# EAGLE design edges_expander_v01 (EAGLE 5.09)
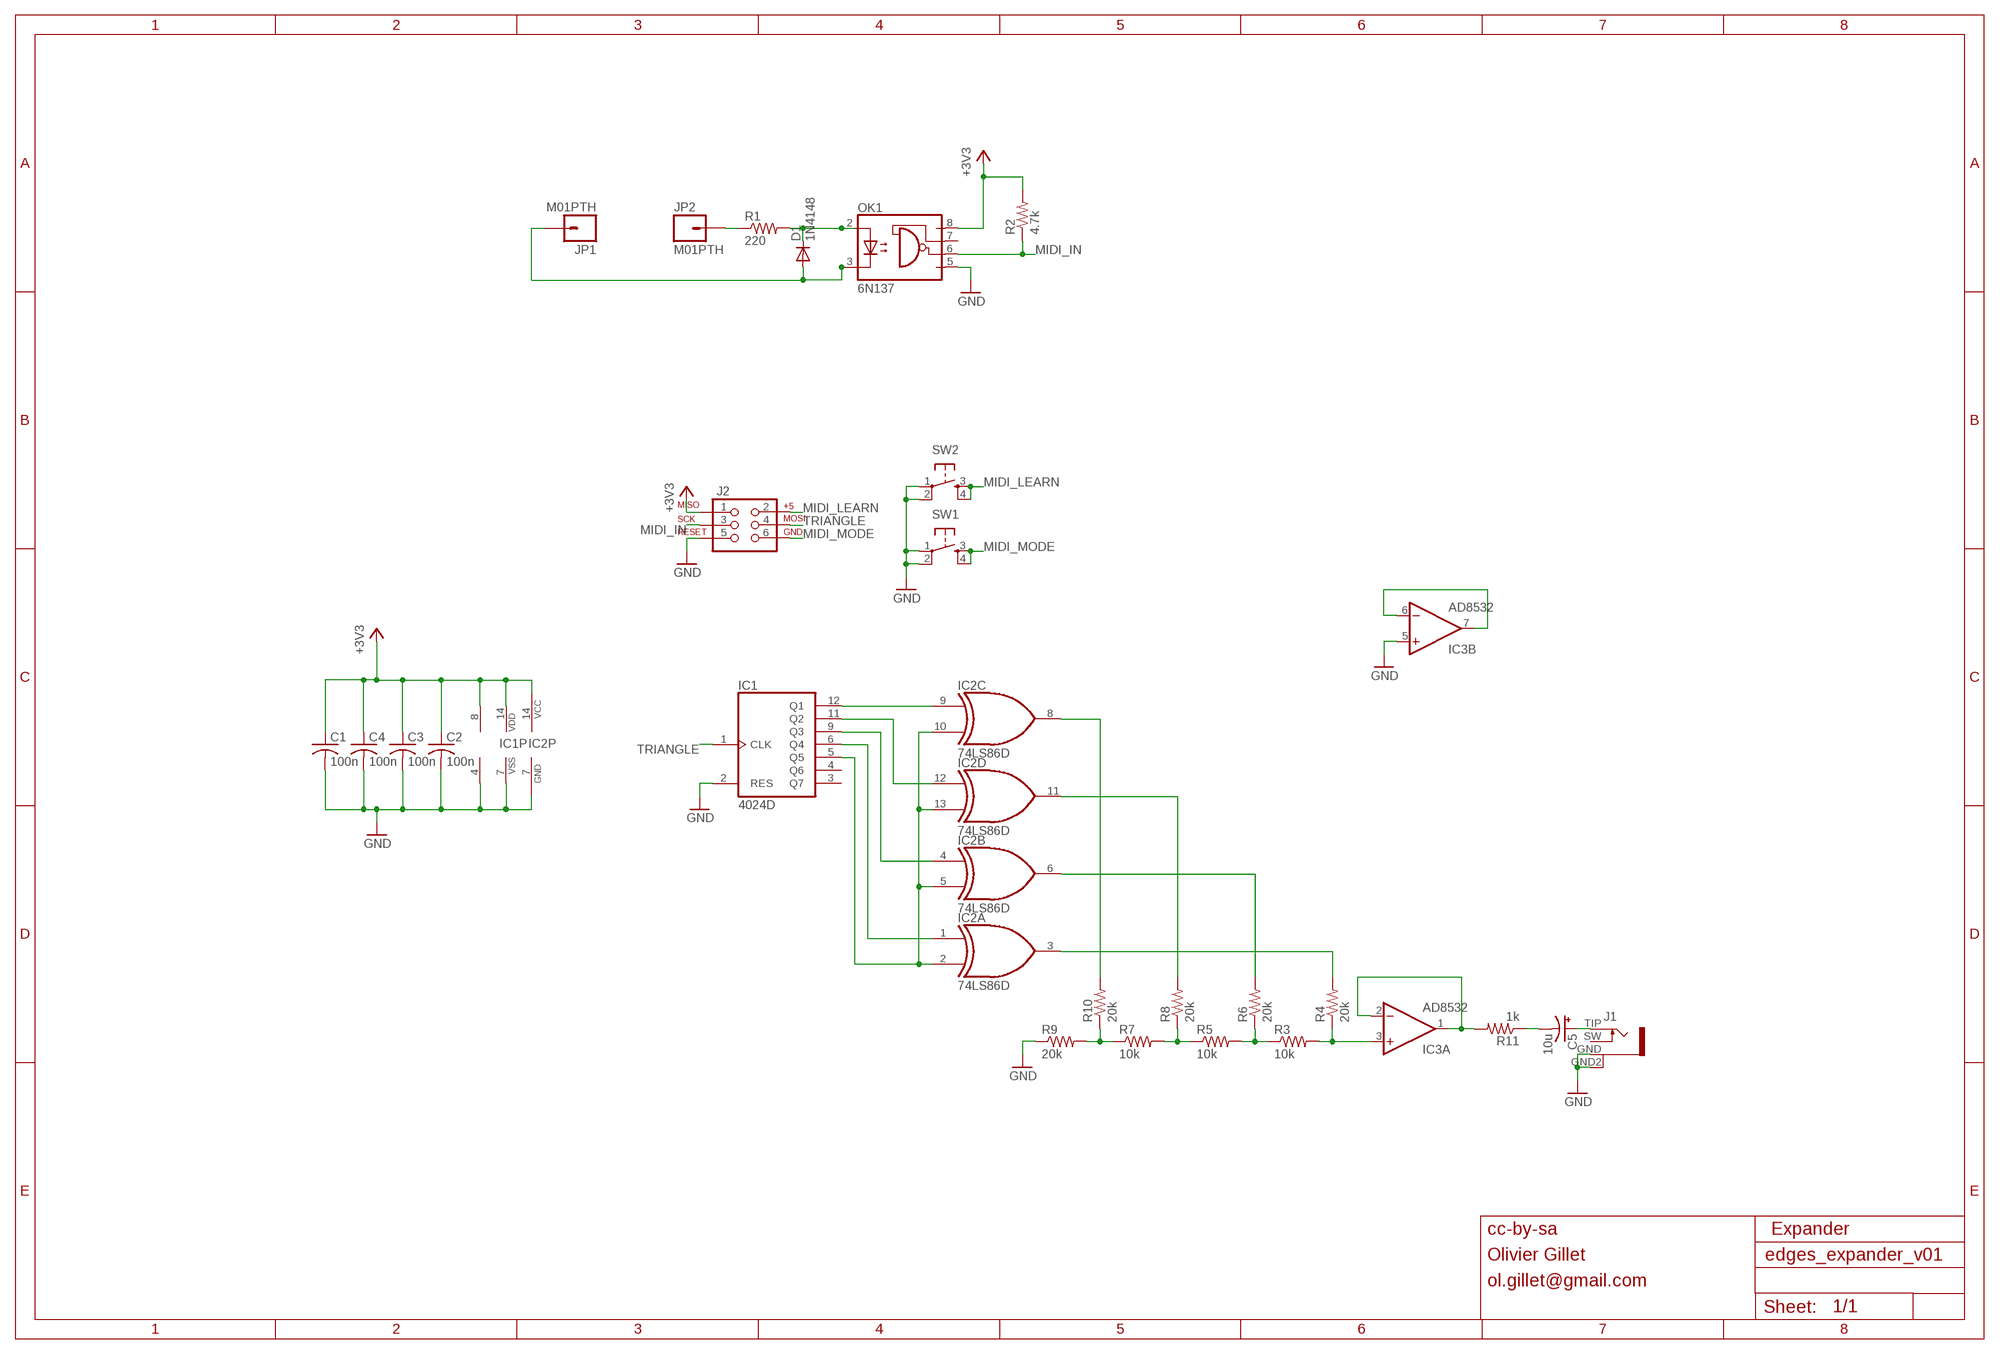
[diagram p0: schematic, sheet 1]

## Parts
C1  100n  C-USC0603  [C0603]
C2  100n  C-USC0603  [C0603]
C3  100n  C-USC0603  [C0603]
C4  100n  C-USC0603  [C0603]
C5  10u  CPOL-USB  [PANASONIC_B]
D1  1N4148  DIODE-SOD323-W  [SOD323-W]
IC1  4024D  [SO14]
IC2  74LS86D  [SO14]
IC3  AD8532  TL072D  [SO08]
J1  PJ301WQP  [WQP_PJ_301BM]
J2  AVR_SPI_PRG_6PTH  [2X3]
JP1  M01PTH  [1X01]
JP2  M01PTH  [1X01]
OK1  6N137  6N137SMT  [DIL8-SMD]
R1  220  R-US_R0603  [R0603]
R2  4.7k  R-US_R0603  [R0603]
R3  10k  R-US_R0603  [R0603]
R4  20k  R-US_R0603  [R0603]
R5  10k  R-US_R0603  [R0603]
R6  20k  R-US_R0603  [R0603]
R7  10k  R-US_R0603  [R0603]
R8  20k  R-US_R0603  [R0603]
R9  20k  R-US_R0603  [R0603]
R10  20k  R-US_R0603  [R0603]
R11  1k  R-US_R0603  [R0603]
SW1  TAC_SWITCHPTH  [TACTILE-PTH]
SW2  TAC_SWITCHPTH  [TACTILE-PTH]

## Nets
+3V3_EXP: C1.1 C2.1 C3.1 C4.1 IC1.14(VDD) IC2.14(P:VCC) IC3.8(P:V+) J2.1 OK1.8(VCC) R2.2 ; supply symbol labelled +3V3
GND: C1.2 C2.2 C3.2 C4.2 IC1.2(RES) IC1.7(VSS) IC2.7(P:GND) IC3.4(P:V-) IC3.5(B:+IN) J1.GND J1.GND2 J2.5 OK1.5(GND) R9.1 SW1.1 SW1.2 SW2.1 SW2.2
MIDI_IN: J2.3 OK1.6(VO) R2.1
MIDI_IN4: JP2.1 R1.1
MIDI_IN5: D1.A JP1.1 OK1.3(C)
MIDI_LEARN: J2.2 SW2.3 SW2.4
MIDI_MODE: J2.6 SW1.3 SW1.4
N$1: IC2.3(A:O) R4.2
N$2: IC2.6(B:O) R6.2
N$3: IC2.11(D:O) R8.2
N$4: IC2.8(C:O) R10.2
N$38: D1.C OK1.2(A) R1.2
N$49: IC1.5(Q5) IC2.2(A:I1) IC2.5(B:I1) IC2.10(C:I1) IC2.13(D:I1)
N$50: IC1.9(Q3) IC2.4(B:I0)
N$51: IC1.11(Q2) IC2.12(D:I0)
N$52: IC1.12(Q1) IC2.9(C:I0)
N$54: IC3.6(B:-IN) IC3.7(B:OUT)
N$56: IC1.6(Q4) IC2.1(A:I0)
N$58: R7.1 R9.2 R10.1
N$59: R5.1 R7.2 R8.1
N$60: R3.1 R5.2 R6.1
N$61: IC3.3(A:+IN) R3.2 R4.1
N$64: C5.- R11.1
N$65: IC3.1(A:OUT) IC3.2(A:-IN) R11.2
N$66: C5.+ J1.TIP
TRIANGLE: IC1.1(CLK) J2.4
Unconnected: IC1.3(Q7) IC1.4(Q6) J1.SW OK1.7(VE)

## Notes on the sheet
- cc-by-sa | Expander
- Olivier Gillet
- ol.gillet@gmail.com

## Library data of the parts
C1-C4 = rcl:C-US: CAPACITOR, American symbol
C5 = rcl:CPOL-US: POLARIZED CAPACITOR, American symbol
D1 = diode:DIODE-: DIODE
IC1 = 40xx:4024: 7-stage binary/ripple COUNTER
IC2 = 74xx-us:74*86: Quad 2-input EXCLUSIV-OR (XOR) gate
IC3 = og-linear:TL072: OP AMP
J1 = og-pj301:PJ301
J2 = SparkFun:AVR_SPI_PRG_6: AVR ISP 6 Pin This is the reduced ISP connector for AVR programming. Common on Arduino. This footprint will take up less PCB space and can be used with a 10-pin to 6-pin adapter such as SKU: BOB-08508
JP1 JP2 = SparkFun:M01: Header 1 Standard 1-pin 0.1" header. Use with straight break away headers (SKU : PRT-00116), right angle break away headers (PRT-00553), swiss pins (PRT-00743), machine pins (PRT-00117), and female headers (PRT-00115).
OK1 = og-optocouplers:6N137: MOTOROLA OPTO COUPLER
R1-R11 = rcl:R-US_: RESISTOR, American symbol
SW1 SW2 = SparkFun:TAC_SWITCH: Momentary Switch Button commonly used for reset or general input. Spark Fun Electronics SKU : COM-00097

## Board
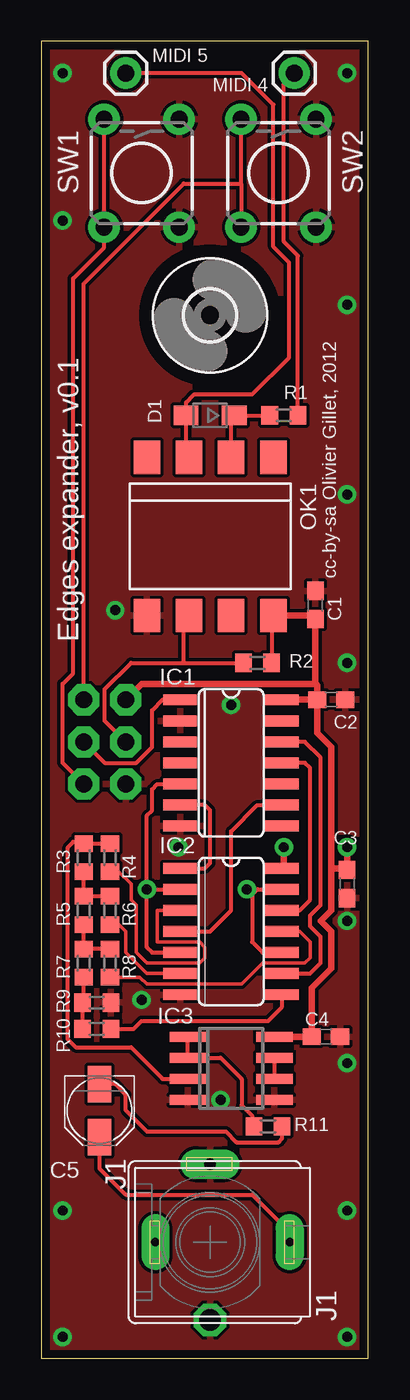
[diagram p1: board, top side]
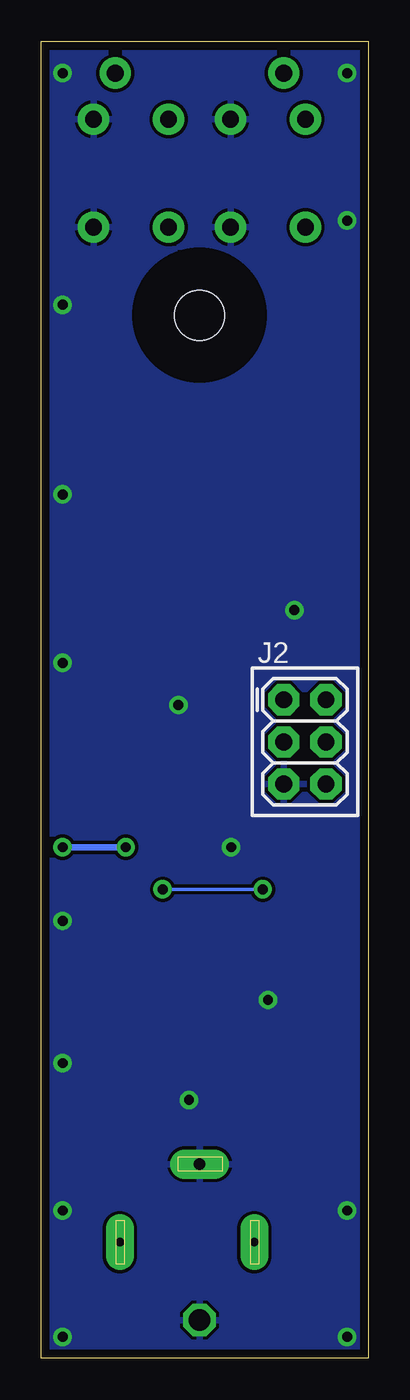
[diagram p2: board, bottom side, seen from below]

Size 19.68 x 79.38 mm. Coordinates in mm from the lower left corner, seen from the top.
Outline: 19.68,79.38 0,79.38 0,0 19.68,0 19.68,79.38
Copper layers (1*16): Top 0.035mm / dielectric 1.5mm / Bottom 0.035mm
Design rules "PCBCart-Standard *": minimum track width 8mil, minimum drill 0.4mm, track to track 8mil, track to pad 8mil, pad to pad 8mil, via to via 8mil, smd to smd 8mil, copper to edge 20mil, drill to drill 8mil, minimum pad ring 8mil, minimum via ring 10mil, stop-mask expansion 3mil, vias tented up to drill 0mil, thermal gap 8mil

### Footprints (pad centres in the part's own frame; a part is rotated, then mirrored left to right if it is on the bottom)
C0603 = smd 1.1 x 1: 1 -0.85,0; 2 0.85,0
PANASONIC_B = smd 2.2 x 1.4: + 1.6,0; - -1.6,0
SOD323-W = smd 1.5 x 1.2: A 1.45,0; C -1.45,0
SO14 = smd 0.66 x 2.032: 1 -3.81,-3.073; 2 -2.54,-3.073; 3 -1.27,-3.073; 4 0,-3.073; 5 1.27,-3.073; 6 2.54,-3.073; 7 3.81,-3.073; 8 3.81,3.073; 9 2.54,3.073; 10 1.27,3.073; 11 0,3.073; 12 -1.27,3.073; 13 -2.54,3.073; 14 -3.81,3.073
SO08 = smd 0.6 x 2.2: 1 -1.905,-2.6; 2 -0.635,-2.6; 3 0.635,-2.6; 4 1.905,-2.6; 5 1.905,2.6; 6 0.635,2.6; 7 -0.635,2.6; 8 -1.905,2.6
WQP_PJ_301BM = drill 0.7 pad 1.778 long: GND -4.7,0 | drill 1.3 octagon: GND2 4.7,0 | drill 0.5 pad 1.676 long: SW 0,-3.3; TIP 0,4.8
2X3 = drill 1.016 pad 1.88 octagon: 1 0,0; 2 0,2.54; 3 2.54,0; 4 2.54,2.54; 5 5.08,0; 6 5.08,2.54
1X01 = drill 1.016 pad 1.88 round: 1 0,0
DIL8-SMD = smd 1.6 x 2: 1 -3.81,-4.77; 2 -1.27,-4.77; 3 1.27,-4.77; 4 3.81,-4.77; 5 3.81,4.77; 6 1.27,4.77; 7 -1.27,4.77; 8 -3.81,4.77
R0603 = smd 1 x 1.1: 1 -0.85,0; 2 0.85,0
TACTILE-PTH = drill 1.016 pad 1.88 round: 1 -3.251,2.261; 2 3.251,2.261; 3 -3.251,-2.261; 4 3.251,-2.261
3,0 = hole 3: 0,0

### Placement (x,y rotation side)
C1  16.51,45.4 90 top
C2  17.46,39.69 0 top
C3  18.41,28.57 270 top
C4  17.14,19.37 0 top
C5  3.49,14.92 270 top
D1  10.16,56.83 180 top
IC1  11.43,35.88 270 top
IC2  11.43,25.72 270 top
IC3  11.43,17.46 270 top
J1  10.16,6.99 270 top
J2  5.08,39.69 270 bottom
JP1  5.08,77.47 0 top
JP2  15.24,77.47 0 top
OK1  10.16,49.53 180 top
R1  14.61,56.83 180 top
R2  13.02,41.91 0 top
R3  2.54,30.16 90 top
R4  4.13,30.16 270 top
R5  2.54,26.99 90 top
R6  4.13,26.99 270 top
R7  2.54,23.81 90 top
R8  4.13,23.81 270 top
R9  3.33,21.43 180 top
R10  3.33,19.84 0 top
R11  13.65,13.97 180 top
SW1  6.03,71.44 270 top
SW2  14.29,71.44 270 top
U$1  [3,0]  10.16,62.87 0 top
U$2  [EURORACK_TEMPLATE]  0,118.11 0 top  (outside the outline)

### Tracks (layer width: path | path; a pad name or v marks a point on that pad's centre or on a via)
+3V3_EXP  (via drill 0.6)
  Top 0.203: IC2.14 14.29,29.53
  Top 0.254: OK1.8 13.87,44.66 R2.2
  Top 0.406: OK1.8 16.3,44.76 C1.1 16.51,40.64 | 16.83,39.58 16.73,39.69 C2.1 | 17.46,29.53 17.46,26.99 16.83,26.35 17.46,25.72 17.46,23.5 16.3,22.33 C4.1 IC3.8 | 17.46,29.53 17.46,36.83 16.61,37.68 C2.1 | IC2.14 14.61,29.63 v14.61,30.8 | J2.1 6.03,40.64 16.51,40.64 | 16.51,40.64 16.61,40.54 C2.1 | C2.1 IC1.14 | v18.41,30.8 C3.1 18.31,29.53 17.46,29.53
  Bottom 0.406: v18.41,30.8 v14.61,30.8
GND  (via drill 0.6)
  other vias: 8.26,30.8 6.03,21.59 18.41,26.35 4.45,45.08 10.79,15.56 1.27,77.47 18.41,77.47 1.27,68.58 1.27,1.27 1.27,8.89 18.41,1.27 18.41,8.89 18.41,17.78 18.41,41.91 18.41,52.07 18.41,63.5 11.43,39.37
  pour Top (isolate 0.203): 0,79.38 0,0 19.68,0 19.68,79.38
  pour Bottom: 0,79.38 0,0 19.68,0 19.68,79.38
MIDI_IN
  Top 0.254: J2.3 3.81,38.42 3.81,40.32 5.4,41.91 8.57,41.91 | 8.57,41.91 R2.1 | OK1.6 8.57,44.44 8.57,41.91
MIDI_IN4
  Top 0.254: JP2.1 14.61,76.84 14.61,67.31 15.46,66.46 R1.1
MIDI_IN5
  Top 0.254: OK1.3 8.71,54.48 D1.A 8.71,57.6 9.21,58.1 12.7,58.1 14.92,60.32 14.92,66.04 13.97,66.99 13.97,75.56 12.06,77.47 JP1.1
MIDI_LEARN
  Top 0.254: J2.2 2.54,64.77 8.57,70.8 12.03,70.8 | 11.99,68.19 SW2.4 12.03,70.8 | 12.03,70.8 SW2.3
MIDI_MODE
  Top 0.254: SW1.3 SW1.4 3.77,66.95 1.91,65.09 1.91,41.27 1.27,40.64 1.27,35.88 J2.6
N$1
  Top 0.203: IC2.3 6.99,26.99 6.99,25.08 9.53,25.08 9.84,24.77 9.84,24.13 9.53,23.81 6.35,23.81 5.71,24.45 5.71,27.3 5.4,27.62 5.4,28.57 4.66,29.31 R4.2
N$2
  Top 0.203: IC2.6 6.35,23.18 5.08,24.45 5.08,25.72 4.66,26.14 R6.2
N$3
  Top 0.203: IC2.11 15.56,25.72 16.19,25.08 16.19,24.13 15.88,23.81 13.34,23.81 12.06,22.54 6.35,22.54 5.93,22.96 R8.2
N$4
  Top 0.254: IC2.8 14.5,21.17 13.65,20.32 6.03,20.32 5.56,19.84 R10.2
N$38
  Top 0.254: R1.2 D1.C 11.43,56.65 OK1.2
N$49  (via drill 0.6)
  Top 0.203: v12.38,28.26 12.7,27.94
  Top 0.254: IC1.5 6.99,34.61 6.67,34.29 6.67,33.02 6.35,32.7 v6.35,28.26 | v6.35,28.26 6.35,24.77 6.67,24.45 IC2.5 | v6.35,28.26 IC2.2 | IC2.13 13.02,28.26 12.7,27.94 12.7,25.08 13.34,24.45 IC2.10
  Bottom 0.203: v6.35,28.26 v12.38,28.26
N$50
  Top 0.254: IC1.9 13.02,33.34 11.43,31.75 11.43,26.99 10.16,25.72 IC2.4
N$51
  Top 0.254: IC1.11 15.88,35.88 16.19,35.56 16.19,27.62 15.56,26.99 IC2.12
N$52
  Top 0.254: IC1.12 15.88,37.15 16.83,36.2 16.83,27.3 16.19,26.67 16.19,26.04 16.83,25.4 16.83,23.81 16.19,23.18 IC2.9
N$54
  Top 0.254: IC3.7 IC3.6
N$56
  Top 0.254: IC2.1 9.84,29.53 10.16,29.84 10.16,33.02 9.84,33.34 IC1.6
N$58
  Top 0.254: R10.1 | R10.1 R9.2 2.54,21.49 R7.1
N$59
  Top 0.254: R5.1 R7.2 R8.1
N$60
  Top 0.254: R3.1 R5.2 R6.1
N$61
  Top 0.254: 8.89,16.83 IC3.3 7.3,16.83 5.4,18.73 2.06,18.73 1.59,19.21 1.59,30.8 1.91,31.11 2.44,31.11 R3.2 R4.1
N$64
  Top 0.254: C5.- 4.43,16.52 5.08,15.88 5.08,14.92 6.35,13.65 11.11,13.65 11.75,13.02 14.29,13.02 14.5,13.23 R11.1
N$65
  Top 0.254: IC3.1 IC3.2 10.79,18.1 12.06,16.83 12.06,15.24 12.7,14.61 12.7,14.07 R11.2
N$66
  Top 0.254: J1.TIP 14.61,7.34 14.61,7.94 12.7,9.84 5.08,9.84 3.49,11.43 C5.+
TRIANGLE
  Top 0.254: 8.26,39.69 IC1.1 7.3,39.69 6.67,39.05 6.67,36.83 5.71,35.88 3.81,35.88 J2.4

### Text on the board
tPlace: MIDI 5 | MIDI 4
tNames: cc-by-sa Olivier Gillet, 2012 | Edges expander, v0.1 | J1